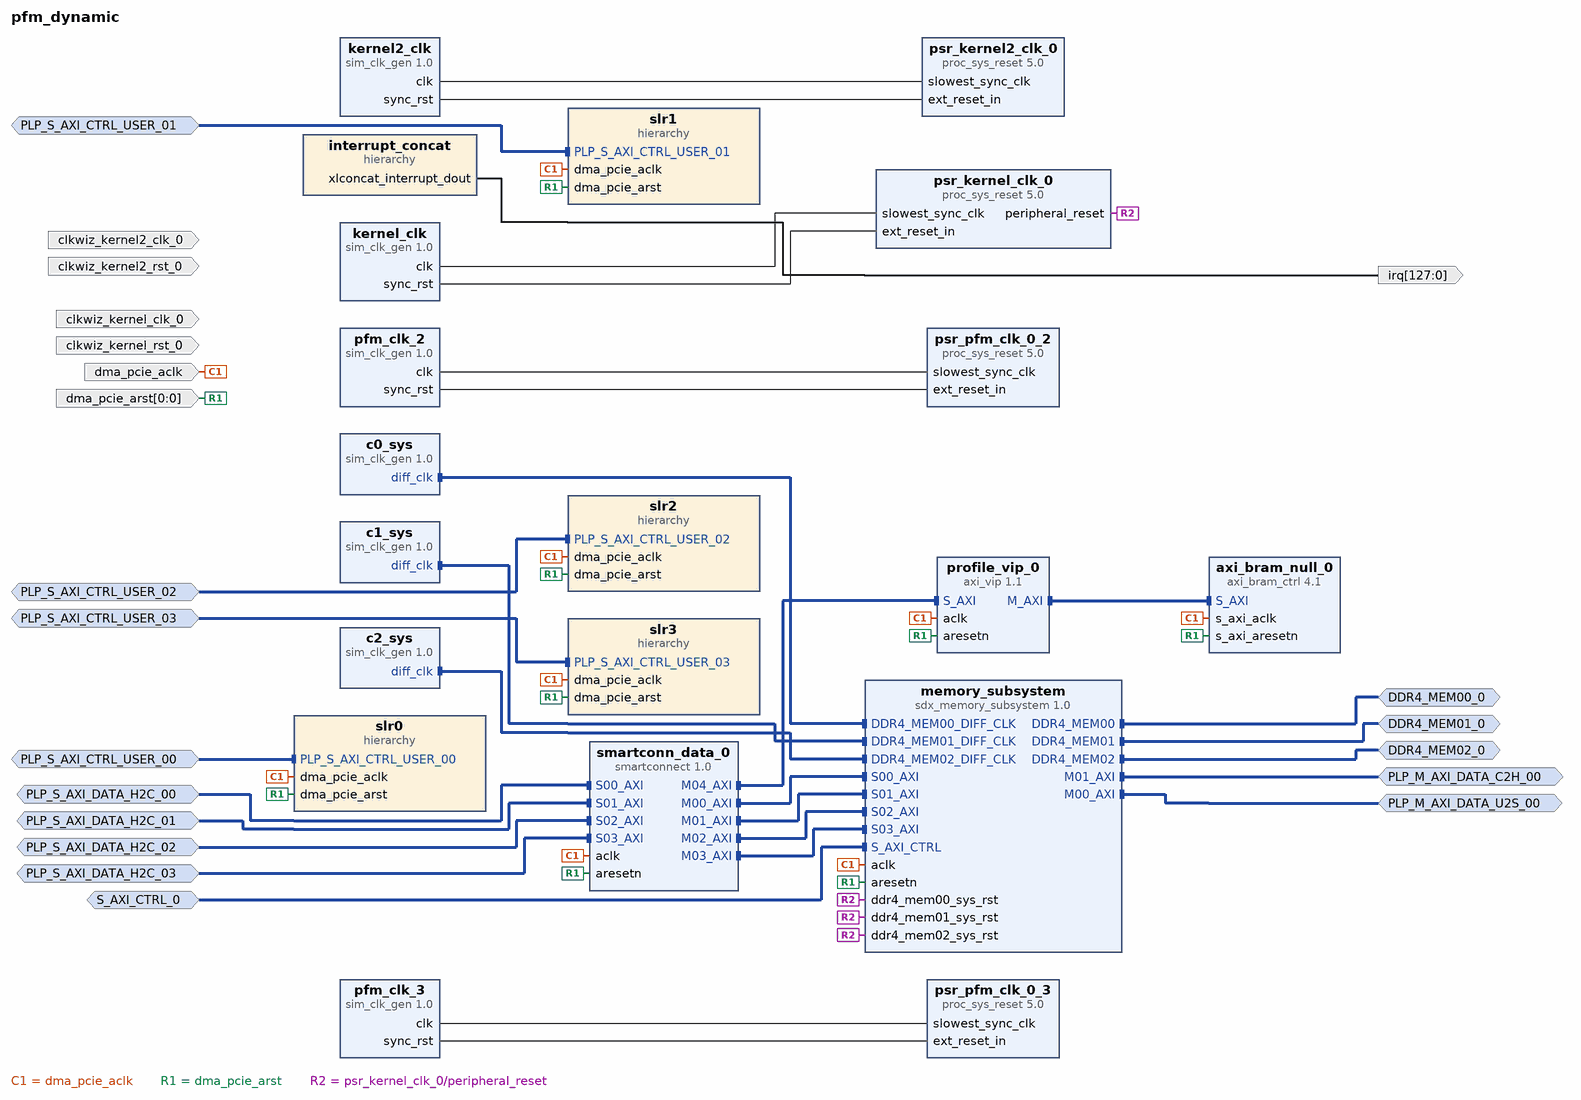
[diagram p0: block diagram of the top level]
# Vivado block design pfm_dynamic, xcu250-figd2104-2L-e, Vivado 2022.1
create_bd_design pfm_dynamic

create_bd_intf_port -mode Master -vlnv xilinx.com:interface:aximm_rtl:1.0 PLP_M_AXI_DATA_C2H_00
set_property -dict [list \
  CONFIG.ADDR_WIDTH 38 \
  CONFIG.DATA_WIDTH 32 \
  CONFIG.FREQ_HZ 300000000 \
  CONFIG.PROTOCOL AXI4 \
] [get_bd_intf_ports PLP_M_AXI_DATA_C2H_00]
create_bd_intf_port -mode Master -vlnv xilinx.com:interface:aximm_rtl:1.0 PLP_M_AXI_DATA_U2S_00
set_property -dict [list \
  CONFIG.ADDR_WIDTH 39 \
  CONFIG.DATA_WIDTH 512 \
  CONFIG.FREQ_HZ 300000000 \
  CONFIG.PROTOCOL AXI4 \
] [get_bd_intf_ports PLP_M_AXI_DATA_U2S_00]
create_bd_intf_port -mode Slave -vlnv xilinx.com:interface:aximm_rtl:1.0 PLP_S_AXI_DATA_H2C_00
set_property -dict [list \
  CONFIG.ADDR_WIDTH 64 \
  CONFIG.ARUSER_WIDTH 0 \
  CONFIG.AWUSER_WIDTH 0 \
  CONFIG.BUSER_WIDTH 0 \
  CONFIG.DATA_WIDTH 32 \
  CONFIG.FREQ_HZ 300000000 \
  CONFIG.HAS_BRESP 1 \
  CONFIG.HAS_BURST 1 \
  CONFIG.HAS_CACHE 0 \
  CONFIG.HAS_LOCK 0 \
  CONFIG.HAS_PROT 1 \
  CONFIG.HAS_QOS 0 \
  CONFIG.HAS_REGION 0 \
  CONFIG.HAS_RRESP 1 \
  CONFIG.HAS_WSTRB 1 \
  CONFIG.ID_WIDTH 1 \
  CONFIG.MAX_BURST_LENGTH 256 \
  CONFIG.NUM_READ_OUTSTANDING 2 \
  CONFIG.NUM_READ_THREADS 1 \
  CONFIG.NUM_WRITE_OUTSTANDING 2 \
  CONFIG.NUM_WRITE_THREADS 1 \
  CONFIG.PROTOCOL AXI4 \
  CONFIG.READ_WRITE_MODE READ_WRITE \
  CONFIG.RUSER_BITS_PER_BYTE 0 \
  CONFIG.RUSER_WIDTH 0 \
  CONFIG.SUPPORTS_NARROW_BURST 1 \
  CONFIG.WUSER_BITS_PER_BYTE 0 \
  CONFIG.WUSER_WIDTH 0 \
  CONFIG.master_id 1 \
] [get_bd_intf_ports PLP_S_AXI_DATA_H2C_00]
create_bd_intf_port -mode Slave -vlnv xilinx.com:interface:aximm_rtl:1.0 PLP_S_AXI_DATA_H2C_01
set_property -dict [list \
  CONFIG.ADDR_WIDTH 64 \
  CONFIG.ARUSER_WIDTH 0 \
  CONFIG.AWUSER_WIDTH 0 \
  CONFIG.BUSER_WIDTH 0 \
  CONFIG.DATA_WIDTH 32 \
  CONFIG.FREQ_HZ 300000000 \
  CONFIG.HAS_BRESP 1 \
  CONFIG.HAS_BURST 1 \
  CONFIG.HAS_CACHE 0 \
  CONFIG.HAS_LOCK 0 \
  CONFIG.HAS_PROT 1 \
  CONFIG.HAS_QOS 0 \
  CONFIG.HAS_REGION 0 \
  CONFIG.HAS_RRESP 1 \
  CONFIG.HAS_WSTRB 1 \
  CONFIG.ID_WIDTH 1 \
  CONFIG.MAX_BURST_LENGTH 256 \
  CONFIG.NUM_READ_OUTSTANDING 2 \
  CONFIG.NUM_READ_THREADS 1 \
  CONFIG.NUM_WRITE_OUTSTANDING 2 \
  CONFIG.NUM_WRITE_THREADS 1 \
  CONFIG.PROTOCOL AXI4 \
  CONFIG.READ_WRITE_MODE READ_WRITE \
  CONFIG.RUSER_BITS_PER_BYTE 0 \
  CONFIG.RUSER_WIDTH 0 \
  CONFIG.SUPPORTS_NARROW_BURST 1 \
  CONFIG.WUSER_BITS_PER_BYTE 0 \
  CONFIG.WUSER_WIDTH 0 \
  CONFIG.master_id 2 \
] [get_bd_intf_ports PLP_S_AXI_DATA_H2C_01]
create_bd_intf_port -mode Slave -vlnv xilinx.com:interface:aximm_rtl:1.0 PLP_S_AXI_DATA_H2C_02
set_property -dict [list \
  CONFIG.ADDR_WIDTH 64 \
  CONFIG.ARUSER_WIDTH 0 \
  CONFIG.AWUSER_WIDTH 0 \
  CONFIG.BUSER_WIDTH 0 \
  CONFIG.DATA_WIDTH 32 \
  CONFIG.FREQ_HZ 300000000 \
  CONFIG.HAS_BRESP 1 \
  CONFIG.HAS_BURST 1 \
  CONFIG.HAS_CACHE 0 \
  CONFIG.HAS_LOCK 0 \
  CONFIG.HAS_PROT 1 \
  CONFIG.HAS_QOS 0 \
  CONFIG.HAS_REGION 0 \
  CONFIG.HAS_RRESP 1 \
  CONFIG.HAS_WSTRB 1 \
  CONFIG.ID_WIDTH 1 \
  CONFIG.MAX_BURST_LENGTH 256 \
  CONFIG.NUM_READ_OUTSTANDING 2 \
  CONFIG.NUM_READ_THREADS 1 \
  CONFIG.NUM_WRITE_OUTSTANDING 2 \
  CONFIG.NUM_WRITE_THREADS 1 \
  CONFIG.PROTOCOL AXI4 \
  CONFIG.READ_WRITE_MODE READ_WRITE \
  CONFIG.RUSER_BITS_PER_BYTE 0 \
  CONFIG.RUSER_WIDTH 0 \
  CONFIG.SUPPORTS_NARROW_BURST 1 \
  CONFIG.WUSER_BITS_PER_BYTE 0 \
  CONFIG.WUSER_WIDTH 0 \
  CONFIG.master_id 3 \
] [get_bd_intf_ports PLP_S_AXI_DATA_H2C_02]
create_bd_intf_port -mode Slave -vlnv xilinx.com:interface:aximm_rtl:1.0 PLP_S_AXI_DATA_H2C_03
set_property -dict [list \
  CONFIG.ADDR_WIDTH 64 \
  CONFIG.ARUSER_WIDTH 0 \
  CONFIG.AWUSER_WIDTH 0 \
  CONFIG.BUSER_WIDTH 0 \
  CONFIG.DATA_WIDTH 32 \
  CONFIG.FREQ_HZ 300000000 \
  CONFIG.HAS_BRESP 1 \
  CONFIG.HAS_BURST 1 \
  CONFIG.HAS_CACHE 0 \
  CONFIG.HAS_LOCK 0 \
  CONFIG.HAS_PROT 1 \
  CONFIG.HAS_QOS 0 \
  CONFIG.HAS_REGION 0 \
  CONFIG.HAS_RRESP 1 \
  CONFIG.HAS_WSTRB 1 \
  CONFIG.ID_WIDTH 1 \
  CONFIG.MAX_BURST_LENGTH 256 \
  CONFIG.NUM_READ_OUTSTANDING 2 \
  CONFIG.NUM_READ_THREADS 1 \
  CONFIG.NUM_WRITE_OUTSTANDING 2 \
  CONFIG.NUM_WRITE_THREADS 1 \
  CONFIG.PROTOCOL AXI4 \
  CONFIG.READ_WRITE_MODE READ_WRITE \
  CONFIG.RUSER_BITS_PER_BYTE 0 \
  CONFIG.RUSER_WIDTH 0 \
  CONFIG.SUPPORTS_NARROW_BURST 1 \
  CONFIG.WUSER_BITS_PER_BYTE 0 \
  CONFIG.WUSER_WIDTH 0 \
  CONFIG.master_id 4 \
] [get_bd_intf_ports PLP_S_AXI_DATA_H2C_03]
create_bd_intf_port -mode Slave -vlnv xilinx.com:interface:aximm_rtl:1.0 PLP_S_AXI_CTRL_USER_00
set_property -dict [list \
  CONFIG.ADDR_WIDTH 64 \
  CONFIG.ARUSER_WIDTH 0 \
  CONFIG.AWUSER_WIDTH 0 \
  CONFIG.BUSER_WIDTH 0 \
  CONFIG.DATA_WIDTH 32 \
  CONFIG.FREQ_HZ 300000000 \
  CONFIG.HAS_BRESP 1 \
  CONFIG.HAS_BURST 0 \
  CONFIG.HAS_CACHE 0 \
  CONFIG.HAS_LOCK 0 \
  CONFIG.HAS_PROT 1 \
  CONFIG.HAS_QOS 0 \
  CONFIG.HAS_REGION 0 \
  CONFIG.HAS_RRESP 1 \
  CONFIG.HAS_WSTRB 1 \
  CONFIG.ID_WIDTH 0 \
  CONFIG.MAX_BURST_LENGTH 1 \
  CONFIG.NUM_READ_OUTSTANDING 2 \
  CONFIG.NUM_READ_THREADS 1 \
  CONFIG.NUM_WRITE_OUTSTANDING 2 \
  CONFIG.NUM_WRITE_THREADS 1 \
  CONFIG.PROTOCOL AXI4LITE \
  CONFIG.READ_WRITE_MODE READ_WRITE \
  CONFIG.RUSER_BITS_PER_BYTE 0 \
  CONFIG.RUSER_WIDTH 0 \
  CONFIG.SUPPORTS_NARROW_BURST 0 \
  CONFIG.WUSER_BITS_PER_BYTE 0 \
  CONFIG.WUSER_WIDTH 0 \
] [get_bd_intf_ports PLP_S_AXI_CTRL_USER_00]
create_bd_intf_port -mode Slave -vlnv xilinx.com:interface:aximm_rtl:1.0 PLP_S_AXI_CTRL_USER_01
set_property -dict [list \
  CONFIG.ADDR_WIDTH 64 \
  CONFIG.ARUSER_WIDTH 0 \
  CONFIG.AWUSER_WIDTH 0 \
  CONFIG.BUSER_WIDTH 0 \
  CONFIG.DATA_WIDTH 32 \
  CONFIG.FREQ_HZ 300000000 \
  CONFIG.HAS_BRESP 1 \
  CONFIG.HAS_BURST 0 \
  CONFIG.HAS_CACHE 0 \
  CONFIG.HAS_LOCK 0 \
  CONFIG.HAS_PROT 1 \
  CONFIG.HAS_QOS 0 \
  CONFIG.HAS_REGION 0 \
  CONFIG.HAS_RRESP 1 \
  CONFIG.HAS_WSTRB 1 \
  CONFIG.ID_WIDTH 0 \
  CONFIG.MAX_BURST_LENGTH 1 \
  CONFIG.NUM_READ_OUTSTANDING 2 \
  CONFIG.NUM_READ_THREADS 1 \
  CONFIG.NUM_WRITE_OUTSTANDING 2 \
  CONFIG.NUM_WRITE_THREADS 1 \
  CONFIG.PROTOCOL AXI4LITE \
  CONFIG.READ_WRITE_MODE READ_WRITE \
  CONFIG.RUSER_BITS_PER_BYTE 0 \
  CONFIG.RUSER_WIDTH 0 \
  CONFIG.SUPPORTS_NARROW_BURST 0 \
  CONFIG.WUSER_BITS_PER_BYTE 0 \
  CONFIG.WUSER_WIDTH 0 \
] [get_bd_intf_ports PLP_S_AXI_CTRL_USER_01]
create_bd_intf_port -mode Slave -vlnv xilinx.com:interface:aximm_rtl:1.0 PLP_S_AXI_CTRL_USER_02
set_property -dict [list \
  CONFIG.ADDR_WIDTH 64 \
  CONFIG.ARUSER_WIDTH 0 \
  CONFIG.AWUSER_WIDTH 0 \
  CONFIG.BUSER_WIDTH 0 \
  CONFIG.DATA_WIDTH 32 \
  CONFIG.FREQ_HZ 300000000 \
  CONFIG.HAS_BRESP 1 \
  CONFIG.HAS_BURST 0 \
  CONFIG.HAS_CACHE 0 \
  CONFIG.HAS_LOCK 0 \
  CONFIG.HAS_PROT 1 \
  CONFIG.HAS_QOS 0 \
  CONFIG.HAS_REGION 0 \
  CONFIG.HAS_RRESP 1 \
  CONFIG.HAS_WSTRB 1 \
  CONFIG.ID_WIDTH 0 \
  CONFIG.MAX_BURST_LENGTH 1 \
  CONFIG.NUM_READ_OUTSTANDING 2 \
  CONFIG.NUM_READ_THREADS 1 \
  CONFIG.NUM_WRITE_OUTSTANDING 2 \
  CONFIG.NUM_WRITE_THREADS 1 \
  CONFIG.PROTOCOL AXI4LITE \
  CONFIG.READ_WRITE_MODE READ_WRITE \
  CONFIG.RUSER_BITS_PER_BYTE 0 \
  CONFIG.RUSER_WIDTH 0 \
  CONFIG.SUPPORTS_NARROW_BURST 0 \
  CONFIG.WUSER_BITS_PER_BYTE 0 \
  CONFIG.WUSER_WIDTH 0 \
] [get_bd_intf_ports PLP_S_AXI_CTRL_USER_02]
create_bd_intf_port -mode Slave -vlnv xilinx.com:interface:aximm_rtl:1.0 PLP_S_AXI_CTRL_USER_03
set_property -dict [list \
  CONFIG.ADDR_WIDTH 64 \
  CONFIG.ARUSER_WIDTH 0 \
  CONFIG.AWUSER_WIDTH 0 \
  CONFIG.BUSER_WIDTH 0 \
  CONFIG.DATA_WIDTH 32 \
  CONFIG.FREQ_HZ 300000000 \
  CONFIG.HAS_BRESP 1 \
  CONFIG.HAS_BURST 0 \
  CONFIG.HAS_CACHE 0 \
  CONFIG.HAS_LOCK 0 \
  CONFIG.HAS_PROT 1 \
  CONFIG.HAS_QOS 0 \
  CONFIG.HAS_REGION 0 \
  CONFIG.HAS_RRESP 1 \
  CONFIG.HAS_WSTRB 1 \
  CONFIG.ID_WIDTH 0 \
  CONFIG.MAX_BURST_LENGTH 1 \
  CONFIG.NUM_READ_OUTSTANDING 2 \
  CONFIG.NUM_READ_THREADS 1 \
  CONFIG.NUM_WRITE_OUTSTANDING 2 \
  CONFIG.NUM_WRITE_THREADS 1 \
  CONFIG.PROTOCOL AXI4LITE \
  CONFIG.READ_WRITE_MODE READ_WRITE \
  CONFIG.RUSER_BITS_PER_BYTE 0 \
  CONFIG.RUSER_WIDTH 0 \
  CONFIG.SUPPORTS_NARROW_BURST 0 \
  CONFIG.WUSER_BITS_PER_BYTE 0 \
  CONFIG.WUSER_WIDTH 0 \
] [get_bd_intf_ports PLP_S_AXI_CTRL_USER_03]
create_bd_intf_port -mode Slave -vlnv xilinx.com:interface:aximm_rtl:1.0 S_AXI_CTRL_0
set_property -dict [list \
  CONFIG.ADDR_WIDTH 32 \
  CONFIG.ARUSER_WIDTH 0 \
  CONFIG.AWUSER_WIDTH 0 \
  CONFIG.BUSER_WIDTH 0 \
  CONFIG.DATA_WIDTH 32 \
  CONFIG.FREQ_HZ 300000000 \
  CONFIG.HAS_BRESP 1 \
  CONFIG.HAS_BURST 1 \
  CONFIG.HAS_CACHE 1 \
  CONFIG.HAS_LOCK 1 \
  CONFIG.HAS_PROT 1 \
  CONFIG.HAS_QOS 1 \
  CONFIG.HAS_REGION 1 \
  CONFIG.HAS_RRESP 1 \
  CONFIG.HAS_WSTRB 1 \
  CONFIG.ID_WIDTH 0 \
  CONFIG.MAX_BURST_LENGTH 1 \
  CONFIG.NUM_READ_OUTSTANDING 1 \
  CONFIG.NUM_READ_THREADS 1 \
  CONFIG.NUM_WRITE_OUTSTANDING 1 \
  CONFIG.NUM_WRITE_THREADS 1 \
  CONFIG.PROTOCOL AXI4LITE \
  CONFIG.READ_WRITE_MODE READ_WRITE \
  CONFIG.RUSER_BITS_PER_BYTE 0 \
  CONFIG.RUSER_WIDTH 0 \
  CONFIG.SUPPORTS_NARROW_BURST 0 \
  CONFIG.WUSER_BITS_PER_BYTE 0 \
  CONFIG.WUSER_WIDTH 0 \
] [get_bd_intf_ports S_AXI_CTRL_0]
create_bd_intf_port -mode Master -vlnv xilinx.com:interface:ddr4_rtl:1.0 DDR4_MEM00_0
create_bd_intf_port -mode Master -vlnv xilinx.com:interface:ddr4_rtl:1.0 DDR4_MEM01_0
create_bd_intf_port -mode Master -vlnv xilinx.com:interface:ddr4_rtl:1.0 DDR4_MEM02_0
create_bd_port -dir I -type clk clkwiz_kernel2_clk_0
set_property -dict {CONFIG.FREQ_HZ 500000000} [get_bd_ports clkwiz_kernel2_clk_0]
create_bd_port -dir I -type clk clkwiz_kernel_clk_0
set_property -dict {CONFIG.FREQ_HZ 300000000} [get_bd_ports clkwiz_kernel_clk_0]
create_bd_port -dir I -type rst clkwiz_kernel2_rst_0
create_bd_port -dir I -type rst clkwiz_kernel_rst_0
create_bd_port -dir I -type clk dma_pcie_aclk
set_property -dict [list \
  CONFIG.ASSOCIATED_BUSIF PLP_S_AXI_CTRL_USER_03:PLP_M_AXI_DATA_C2H_00:PLP_M_AXI_DATA_U2S_00:PLP_S_AXI_DATA_H2C_00:PLP_S_AXI_DATA_H2C_01:PLP_S_AXI_DATA_H2C_02:PLP_S_AXI_DATA_H2C_03:PLP_S_AXI_CTRL_USER_00:PLP_S_AXI_CTRL_USER_01:PLP_S_AXI_CTRL_USER_02:S_AXI_CTRL_0 \
  CONFIG.FREQ_HZ 300000000 \
] [get_bd_ports dma_pcie_aclk]
create_bd_port -dir O -from 127 -to 0 -type intr irq
create_bd_port -dir I -from 0 -to 0 -type rst dma_pcie_arst

create_bd_cell -type ip -vlnv xilinx.com:ip:sim_clk_gen:1.0 pfm_clk_2
set_property -dict {CONFIG.FREQ_HZ 50000000} [get_bd_cells pfm_clk_2]
create_bd_cell -type ip -vlnv xilinx.com:ip:proc_sys_reset:5.0 psr_pfm_clk_0_2
create_bd_cell -type ip -vlnv xilinx.com:ip:sim_clk_gen:1.0 pfm_clk_3
set_property -dict {CONFIG.FREQ_HZ 250000000} [get_bd_cells pfm_clk_3]
create_bd_cell -type ip -vlnv xilinx.com:ip:proc_sys_reset:5.0 psr_pfm_clk_0_3
create_bd_cell -type ip -vlnv xilinx.com:ip:sim_clk_gen:1.0 kernel2_clk
set_property -dict {CONFIG.FREQ_HZ 500000000} [get_bd_cells kernel2_clk]
create_bd_cell -type ip -vlnv xilinx.com:ip:sim_clk_gen:1.0 kernel_clk
set_property -dict {CONFIG.FREQ_HZ 300000000} [get_bd_cells kernel_clk]
create_bd_cell -type ip -vlnv xilinx.com:ip:proc_sys_reset:5.0 psr_kernel2_clk_0
create_bd_cell -type ip -vlnv xilinx.com:ip:proc_sys_reset:5.0 psr_kernel_clk_0
create_bd_cell -type ip -vlnv xilinx.com:ip:smartconnect:1.0 smartconn_data_0
set_property -dict {CONFIG.NUM_MI 5 CONFIG.NUM_SI 4} [get_bd_cells smartconn_data_0]
create_bd_cell -type hier interrupt_concat
create_bd_cell -type ip -vlnv xilinx.com:ip:sdx_memory_subsystem:1.0 memory_subsystem
set_property -dict [list \
  CONFIG.ADVANCED_PROPERTIES {resource_map_replication { S00_AXI {}  S01_AXI {}  S02_AXI {}  S03_AXI {} } plram_specifications {{SIZE 128K AXI_DATA_WIDTH 512 SLR_ASSIGNMENT SLR0} {SIZE 128K AXI_DATA_WIDTH 512 SLR_ASSIGNMENT SLR1} {SIZE 128K AXI_DATA_WIDTH 512 SLR_ASSIGNMENT SLR2} {SIZE 128K AXI_DATA_WIDTH 512 SLR_ASSIGNMENT SLR3}} resource_access_constraints {S00_AXI {DDR4_MEM00 PLRAM_MEM00 PLRAM_MEM01 PLRAM_MEM02 PLRAM_MEM03} S01_AXI {M00_AXI_MEM00 M01_AXI_MEM00} S02_AXI DDR4_MEM01 S03_AXI DDR4_MEM02} __temp_dsa_info {excluded_board_components xilinx.com:au250:ddr4_sdram_c1:1.4 axi_passthrough {xilinx.com:au250:ddr4_sdram_c1:1.4 {offset 0x5000000000 range 16G slr SLR1} M01_AXI {offset 0x2000000000 range 16G slr SLR2}}}} \
  CONFIG.NUM_CLKS 1 \
  CONFIG.NUM_SI 4 \
] [get_bd_cells memory_subsystem]
create_bd_cell -type ip -vlnv xilinx.com:ip:sim_clk_gen:1.0 c0_sys
set_property -dict {CONFIG.CLOCK_TYPE Differential CONFIG.FREQ_HZ 300000000} [get_bd_cells c0_sys]
create_bd_cell -type ip -vlnv xilinx.com:ip:sim_clk_gen:1.0 c1_sys
set_property -dict {CONFIG.CLOCK_TYPE Differential CONFIG.FREQ_HZ 300000000} [get_bd_cells c1_sys]
create_bd_cell -type ip -vlnv xilinx.com:ip:sim_clk_gen:1.0 c2_sys
set_property -dict {CONFIG.CLOCK_TYPE Differential CONFIG.FREQ_HZ 300000000} [get_bd_cells c2_sys]
create_bd_cell -type ip -vlnv xilinx.com:ip:axi_vip:1.1 profile_vip_0
set_property -dict {CONFIG.INTERFACE_MODE PASS_THROUGH} [get_bd_cells profile_vip_0]
create_bd_cell -type ip -vlnv xilinx.com:ip:axi_bram_ctrl:4.1 axi_bram_null_0
set_property -dict {CONFIG.DATA_WIDTH 64} [get_bd_cells axi_bram_null_0]
create_bd_cell -type hier slr0
create_bd_cell -type hier slr1
create_bd_cell -type hier slr2
create_bd_cell -type hier slr3

# ---- hierarchy /interrupt_concat ----
current_bd_instance /interrupt_concat
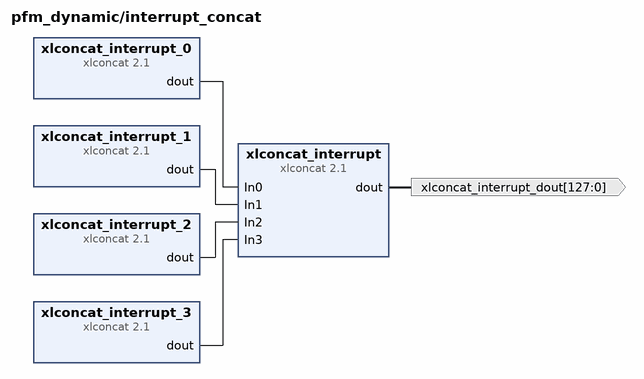
[diagram p1: block diagram inside /interrupt_concat]
create_bd_pin -dir O -from 127 -to 0 xlconcat_interrupt_dout

create_bd_cell -type ip -vlnv xilinx.com:ip:xlconcat:2.1 xlconcat_interrupt
set_property -dict {CONFIG.NUM_PORTS 4} [get_bd_cells xlconcat_interrupt]
create_bd_cell -type ip -vlnv xilinx.com:ip:xlconcat:2.1 xlconcat_interrupt_0
set_property -dict {CONFIG.NUM_PORTS 32} [get_bd_cells xlconcat_interrupt_0]
create_bd_cell -type ip -vlnv xilinx.com:ip:xlconcat:2.1 xlconcat_interrupt_1
set_property -dict {CONFIG.NUM_PORTS 32} [get_bd_cells xlconcat_interrupt_1]
create_bd_cell -type ip -vlnv xilinx.com:ip:xlconcat:2.1 xlconcat_interrupt_2
set_property -dict {CONFIG.NUM_PORTS 32} [get_bd_cells xlconcat_interrupt_2]
create_bd_cell -type ip -vlnv xilinx.com:ip:xlconcat:2.1 xlconcat_interrupt_3
set_property -dict {CONFIG.NUM_PORTS 32} [get_bd_cells xlconcat_interrupt_3]

# ---- hierarchy /slr0 ----
current_bd_instance /slr0
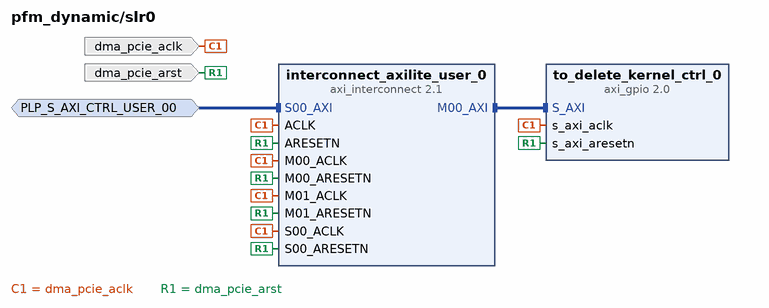
[diagram p2: block diagram inside /slr0]
create_bd_intf_pin -mode Slave -vlnv xilinx.com:interface:aximm_rtl:1.0 PLP_S_AXI_CTRL_USER_00
create_bd_pin -dir I -type clk dma_pcie_aclk
create_bd_pin -dir I -type rst dma_pcie_arst

create_bd_cell -type ip -vlnv xilinx.com:ip:axi_interconnect:2.1 interconnect_axilite_user_0
set_property -dict [list \
  CONFIG.M01_HAS_REGSLICE 1 \
  CONFIG.NUM_MI 2 \
  CONFIG.NUM_SI 1 \
  CONFIG.SLR_ASSIGNMENTS SLR0 \
] [get_bd_cells interconnect_axilite_user_0]
create_bd_cell -type ip -vlnv xilinx.com:ip:axi_gpio:2.0 to_delete_kernel_ctrl_0

# ---- hierarchy /slr1 ----
current_bd_instance /slr1
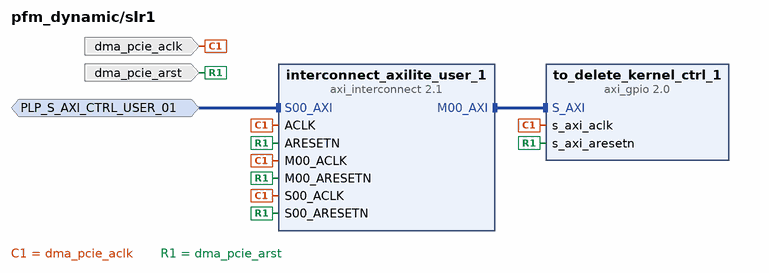
[diagram p3: block diagram inside /slr1]
create_bd_intf_pin -mode Slave -vlnv xilinx.com:interface:aximm_rtl:1.0 PLP_S_AXI_CTRL_USER_01
create_bd_pin -dir I -type clk dma_pcie_aclk
create_bd_pin -dir I -type rst dma_pcie_arst

create_bd_cell -type ip -vlnv xilinx.com:ip:axi_interconnect:2.1 interconnect_axilite_user_1
set_property -dict [list \
  CONFIG.M01_HAS_REGSLICE 1 \
  CONFIG.NUM_MI 1 \
  CONFIG.NUM_SI 1 \
  CONFIG.SLR_ASSIGNMENTS SLR1 \
] [get_bd_cells interconnect_axilite_user_1]
create_bd_cell -type ip -vlnv xilinx.com:ip:axi_gpio:2.0 to_delete_kernel_ctrl_1

# ---- hierarchy /slr2 ----
current_bd_instance /slr2
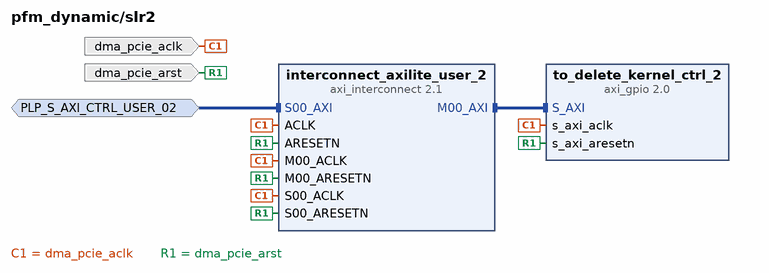
[diagram p4: block diagram inside /slr2]
create_bd_intf_pin -mode Slave -vlnv xilinx.com:interface:aximm_rtl:1.0 PLP_S_AXI_CTRL_USER_02
create_bd_pin -dir I -type clk dma_pcie_aclk
create_bd_pin -dir I -type rst dma_pcie_arst

create_bd_cell -type ip -vlnv xilinx.com:ip:axi_interconnect:2.1 interconnect_axilite_user_2
set_property -dict [list \
  CONFIG.M01_HAS_REGSLICE 1 \
  CONFIG.NUM_MI 1 \
  CONFIG.NUM_SI 1 \
  CONFIG.SLR_ASSIGNMENTS SLR2 \
] [get_bd_cells interconnect_axilite_user_2]
create_bd_cell -type ip -vlnv xilinx.com:ip:axi_gpio:2.0 to_delete_kernel_ctrl_2

# ---- hierarchy /slr3 ----
current_bd_instance /slr3
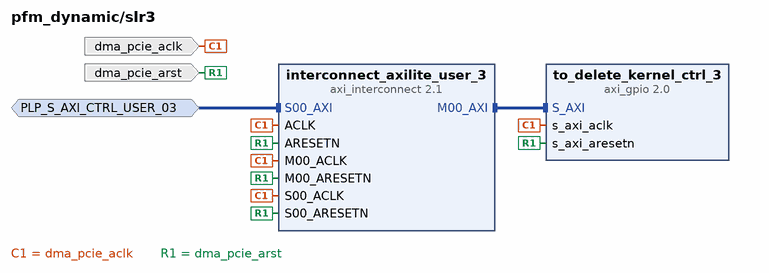
[diagram p5: block diagram inside /slr3]
create_bd_intf_pin -mode Slave -vlnv xilinx.com:interface:aximm_rtl:1.0 PLP_S_AXI_CTRL_USER_03
create_bd_pin -dir I -type clk dma_pcie_aclk
create_bd_pin -dir I -type rst dma_pcie_arst

create_bd_cell -type ip -vlnv xilinx.com:ip:axi_interconnect:2.1 interconnect_axilite_user_3
set_property -dict [list \
  CONFIG.M01_HAS_REGSLICE 1 \
  CONFIG.NUM_MI 1 \
  CONFIG.NUM_SI 1 \
  CONFIG.SLR_ASSIGNMENTS SLR3 \
] [get_bd_cells interconnect_axilite_user_3]
create_bd_cell -type ip -vlnv xilinx.com:ip:axi_gpio:2.0 to_delete_kernel_ctrl_3

# ---- connections ----

current_bd_instance /interrupt_concat
connect_bd_net [get_bd_pins xlconcat_interrupt_0/dout] [get_bd_pins xlconcat_interrupt/In0]
connect_bd_net [get_bd_pins xlconcat_interrupt_1/dout] [get_bd_pins xlconcat_interrupt/In1]
connect_bd_net [get_bd_pins xlconcat_interrupt_2/dout] [get_bd_pins xlconcat_interrupt/In2]
connect_bd_net [get_bd_pins xlconcat_interrupt_3/dout] [get_bd_pins xlconcat_interrupt/In3]
connect_bd_net [get_bd_pins xlconcat_interrupt/dout] [get_bd_pins xlconcat_interrupt_dout]
set_property PFM.IRQ {In0 {id 0} In1 {id 1} In2 {id 2} In3 {id 3} In4 {id 4} In5 {id 5} In6 {id 6} In7 {id 7} In8 {id 8} In9 {id 9}  In10 {id 10} In11 {id 11} In12 {id 12} In13 {id 13} In14 {id 14} In15 {id 15} In16 {id 16} In17 {id 17} In18 {id 18} In19 {id 19}  In20 {id 20} In21 {id 21} In22 {id 22} In23 {id 23} In24 {id 24} In25 {id 25} In26 {id 26} In27 {id 27} In28 {id 28} In29 {id 29}  In30 {id 30} In31 {id 31}} [get_bd_cells xlconcat_interrupt_0]
set_property PFM.IRQ {In0 {id 32} In1 {id 33} In2 {id 34} In3 {id 35} In4 {id 36} In5 {id 37} In6 {id 38} In7 {id 39} In8 {id 40}  In9 {id 41} In10 {id 42} In11 {id 43} In12 {id 44} In13 {id 45} In14 {id 46} In15 {id 47} In16 {id 48} In17 {id 49} In18 {id 50}  In19 {id 51} In20 {id 52} In21 {id 53} In22 {id 54} In23 {id 55} In24 {id 56} In25 {id 57} In26 {id 58} In27 {id 59} In28 {id 60}  In29 {id 61} In30 {id 62} In31 {id 63}} [get_bd_cells xlconcat_interrupt_1]
set_property PFM.IRQ {In0 {id 64} In1 {id 65} In2 {id 66} In3 {id 67} In4 {id 68} In5 {id 69} In6 {id 70} In7 {id 71} In8 {id 72} In9 {id 73} In10 {id 74}  In11 {id 75} In12 {id 76} In13 {id 77} In14 {id 78} In15 {id 79} In16 {id 80} In17 {id 81} In18 {id 82} In19 {id 83} In20 {id 84}  In21 {id 85} In22 {id 86} In23 {id 87} In24 {id 88} In25 {id 89} In26 {id 90} In27 {id 91} In28 {id 92} In29 {id 93}  In30 {id 94} In31 {id 95}} [get_bd_cells xlconcat_interrupt_2]
set_property PFM.IRQ {In0 {id 96} In1 {id 97} In2 {id 98} In3 {id 99} In4 {id 100} In5 {id 101} In6 {id 102} In7 {id 103} In8 {id 104} In9 {id 105}  In10 {id 106} In11 {id 107} In12 {id 108} In13 {id 109} In14 {id 110} In15 {id 111} In16 {id 112} In17 {id 113} In18 {id 114}  In19 {id 115} In20 {id 116} In21 {id 117} In22 {id 118} In23 {id 119} In24 {id 120} In25 {id 121} In26 {id 122} In27 {id 123}  In28 {id 124} In29 {id 125} In30 {id 126} In31 {id 127}} [get_bd_cells xlconcat_interrupt_3]

current_bd_instance /slr0
connect_bd_intf_net -intf_net interconnect_axilite_0_M00_AXI [get_bd_intf_pins interconnect_axilite_user_0/M00_AXI] [get_bd_intf_pins to_delete_kernel_ctrl_0/S_AXI]
connect_bd_intf_net -intf_net urp_ctrl_PLP_S_AXI_CTRL_USER_00 [get_bd_intf_pins PLP_S_AXI_CTRL_USER_00] [get_bd_intf_pins interconnect_axilite_user_0/S00_AXI]
connect_bd_net -net dma_pcie_aclk_net [get_bd_pins dma_pcie_aclk] \
  [get_bd_pins interconnect_axilite_user_0/M00_ACLK] [get_bd_pins interconnect_axilite_user_0/S00_ACLK] \
  [get_bd_pins interconnect_axilite_user_0/M01_ACLK] [get_bd_pins to_delete_kernel_ctrl_0/s_axi_aclk] \
  [get_bd_pins interconnect_axilite_user_0/ACLK]
connect_bd_net -net dma_pcie_arst_net [get_bd_pins dma_pcie_arst] \
  [get_bd_pins interconnect_axilite_user_0/M00_ARESETN] [get_bd_pins interconnect_axilite_user_0/S00_ARESETN] \
  [get_bd_pins interconnect_axilite_user_0/M01_ARESETN] [get_bd_pins to_delete_kernel_ctrl_0/s_axi_aresetn] \
  [get_bd_pins interconnect_axilite_user_0/ARESETN]
set_property HDL_ATTRIBUTE.DPA_AXILITE_MASTER primary [get_bd_cells interconnect_axilite_user_0]
set_property PFM.AXI_PORT {M02_AXI {memport "M_AXI_GP"} M03_AXI {memport "M_AXI_GP"} M04_AXI {memport "M_AXI_GP"} M05_AXI {memport "M_AXI_GP"} M06_AXI {memport "M_AXI_GP"} M07_AXI {memport "M_AXI_GP"} M08_AXI {memport "M_AXI_GP"} M09_AXI {memport "M_AXI_GP"} M10_AXI {memport "M_AXI_GP"} M11_AXI {memport "M_AXI_GP"} M12_AXI {memport "M_AXI_GP"} M13_AXI {memport "M_AXI_GP"} M14_AXI {memport "M_AXI_GP"} M15_AXI {memport "M_AXI_GP"} M16_AXI {memport "M_AXI_GP"} M17_AXI {memport "M_AXI_GP"} M18_AXI {memport "M_AXI_GP"} M19_AXI {memport "M_AXI_GP"} M20_AXI {memport "M_AXI_GP"} M21_AXI {memport "M_AXI_GP"} M22_AXI {memport "M_AXI_GP"} M23_AXI {memport "M_AXI_GP"} M24_AXI {memport "M_AXI_GP"} M25_AXI {memport "M_AXI_GP"} M26_AXI {memport "M_AXI_GP"} M27_AXI {memport "M_AXI_GP"} M28_AXI {memport "M_AXI_GP"} M29_AXI {memport "M_AXI_GP"} M30_AXI {memport "M_AXI_GP"} M31_AXI {memport "M_AXI_GP"}} [get_bd_cells interconnect_axilite_user_0]

current_bd_instance /slr1
connect_bd_intf_net -intf_net interconnect_axilite_1_M00_AXI [get_bd_intf_pins interconnect_axilite_user_1/M00_AXI] [get_bd_intf_pins to_delete_kernel_ctrl_1/S_AXI]
connect_bd_intf_net -intf_net urp_ctrl_PLP_S_AXI_CTRL_USER_01 [get_bd_intf_pins PLP_S_AXI_CTRL_USER_01] [get_bd_intf_pins interconnect_axilite_user_1/S00_AXI]
connect_bd_net -net dma_pcie_aclk_net [get_bd_pins dma_pcie_aclk] \
  [get_bd_pins interconnect_axilite_user_1/M00_ACLK] [get_bd_pins interconnect_axilite_user_1/S00_ACLK] \
  [get_bd_pins to_delete_kernel_ctrl_1/s_axi_aclk] [get_bd_pins interconnect_axilite_user_1/ACLK]
connect_bd_net -net dma_pcie_arst_net [get_bd_pins dma_pcie_arst] \
  [get_bd_pins interconnect_axilite_user_1/M00_ARESETN] [get_bd_pins interconnect_axilite_user_1/S00_ARESETN] \
  [get_bd_pins to_delete_kernel_ctrl_1/s_axi_aresetn] [get_bd_pins interconnect_axilite_user_1/ARESETN]
set_property PFM.AXI_PORT {M01_AXI {memport "M_AXI_GP"} M02_AXI {memport "M_AXI_GP"} M03_AXI {memport "M_AXI_GP"} M04_AXI {memport "M_AXI_GP"} M05_AXI {memport "M_AXI_GP"} M06_AXI {memport "M_AXI_GP"} M07_AXI {memport "M_AXI_GP"} M08_AXI {memport "M_AXI_GP"} M09_AXI {memport "M_AXI_GP"} M10_AXI {memport "M_AXI_GP"} M11_AXI {memport "M_AXI_GP"} M12_AXI {memport "M_AXI_GP"} M13_AXI {memport "M_AXI_GP"} M14_AXI {memport "M_AXI_GP"} M15_AXI {memport "M_AXI_GP"} M16_AXI {memport "M_AXI_GP"} M17_AXI {memport "M_AXI_GP"} M18_AXI {memport "M_AXI_GP"} M19_AXI {memport "M_AXI_GP"} M20_AXI {memport "M_AXI_GP"} M21_AXI {memport "M_AXI_GP"} M22_AXI {memport "M_AXI_GP"} M23_AXI {memport "M_AXI_GP"} M24_AXI {memport "M_AXI_GP"} M25_AXI {memport "M_AXI_GP"} M26_AXI {memport "M_AXI_GP"} M27_AXI {memport "M_AXI_GP"} M28_AXI {memport "M_AXI_GP"} M29_AXI {memport "M_AXI_GP"} M30_AXI {memport "M_AXI_GP"} M31_AXI {memport "M_AXI_GP"} M32_AXI {memport "M_AXI_GP"} M33_AXI {memport "M_AXI_GP"} M34_AXI {memport "M_AXI_GP"} M35_AXI {memport "M_AXI_GP"} M36_AXI {memport "M_AXI_GP"} M37_AXI {memport "M_AXI_GP"} M38_AXI {memport "M_AXI_GP"} M39_AXI {memport "M_AXI_GP"} M40_AXI {memport "M_AXI_GP"} M41_AXI {memport "M_AXI_GP"} M42_AXI {memport "M_AXI_GP"} M43_AXI {memport "M_AXI_GP"} M44_AXI {memport "M_AXI_GP"} M45_AXI {memport "M_AXI_GP"} M46_AXI {memport "M_AXI_GP"} M47_AXI {memport "M_AXI_GP"} M48_AXI {memport "M_AXI_GP"} M49_AXI {memport "M_AXI_GP"} M50_AXI {memport "M_AXI_GP"} M51_AXI {memport "M_AXI_GP"} M52_AXI {memport "M_AXI_GP"} M53_AXI {memport "M_AXI_GP"} M54_AXI {memport "M_AXI_GP"} M55_AXI {memport "M_AXI_GP"} M56_AXI {memport "M_AXI_GP"} M57_AXI {memport "M_AXI_GP"} M58_AXI {memport "M_AXI_GP"} M59_AXI {memport "M_AXI_GP"} M60_AXI {memport "M_AXI_GP"} M61_AXI {memport "M_AXI_GP"} M62_AXI {memport "M_AXI_GP"}} [get_bd_cells interconnect_axilite_user_1]

current_bd_instance /slr2
connect_bd_intf_net -intf_net interconnect_axilite_2_M00_AXI [get_bd_intf_pins interconnect_axilite_user_2/M00_AXI] [get_bd_intf_pins to_delete_kernel_ctrl_2/S_AXI]
connect_bd_intf_net -intf_net urp_ctrl_PLP_S_AXI_CTRL_USER_02 [get_bd_intf_pins PLP_S_AXI_CTRL_USER_02] [get_bd_intf_pins interconnect_axilite_user_2/S00_AXI]
connect_bd_net -net dma_pcie_aclk_net [get_bd_pins dma_pcie_aclk] \
  [get_bd_pins interconnect_axilite_user_2/M00_ACLK] [get_bd_pins interconnect_axilite_user_2/S00_ACLK] \
  [get_bd_pins to_delete_kernel_ctrl_2/s_axi_aclk] [get_bd_pins interconnect_axilite_user_2/ACLK]
connect_bd_net -net dma_pcie_arst_net [get_bd_pins dma_pcie_arst] \
  [get_bd_pins interconnect_axilite_user_2/M00_ARESETN] [get_bd_pins interconnect_axilite_user_2/S00_ARESETN] \
  [get_bd_pins to_delete_kernel_ctrl_2/s_axi_aresetn] [get_bd_pins interconnect_axilite_user_2/ARESETN]
set_property PFM.AXI_PORT {M01_AXI {memport "M_AXI_GP"} M02_AXI {memport "M_AXI_GP"} M03_AXI {memport "M_AXI_GP"} M04_AXI {memport "M_AXI_GP"} M05_AXI {memport "M_AXI_GP"} M06_AXI {memport "M_AXI_GP"} M07_AXI {memport "M_AXI_GP"} M08_AXI {memport "M_AXI_GP"} M09_AXI {memport "M_AXI_GP"} M10_AXI {memport "M_AXI_GP"} M11_AXI {memport "M_AXI_GP"} M12_AXI {memport "M_AXI_GP"} M13_AXI {memport "M_AXI_GP"} M14_AXI {memport "M_AXI_GP"} M15_AXI {memport "M_AXI_GP"} M16_AXI {memport "M_AXI_GP"} M17_AXI {memport "M_AXI_GP"} M18_AXI {memport "M_AXI_GP"} M19_AXI {memport "M_AXI_GP"} M20_AXI {memport "M_AXI_GP"} M21_AXI {memport "M_AXI_GP"} M22_AXI {memport "M_AXI_GP"} M23_AXI {memport "M_AXI_GP"} M24_AXI {memport "M_AXI_GP"} M25_AXI {memport "M_AXI_GP"} M26_AXI {memport "M_AXI_GP"} M27_AXI {memport "M_AXI_GP"} M28_AXI {memport "M_AXI_GP"} M29_AXI {memport "M_AXI_GP"} M30_AXI {memport "M_AXI_GP"}} [get_bd_cells interconnect_axilite_user_2]

current_bd_instance /slr3
connect_bd_intf_net -intf_net interconnect_axilite_3_M00_AXI [get_bd_intf_pins interconnect_axilite_user_3/M00_AXI] [get_bd_intf_pins to_delete_kernel_ctrl_3/S_AXI]
connect_bd_intf_net -intf_net urp_ctrl_PLP_S_AXI_CTRL_USER_03 [get_bd_intf_pins PLP_S_AXI_CTRL_USER_03] [get_bd_intf_pins interconnect_axilite_user_3/S00_AXI]
connect_bd_net -net dma_pcie_aclk_net [get_bd_pins dma_pcie_aclk] \
  [get_bd_pins interconnect_axilite_user_3/M00_ACLK] [get_bd_pins interconnect_axilite_user_3/S00_ACLK] \
  [get_bd_pins to_delete_kernel_ctrl_3/s_axi_aclk] [get_bd_pins interconnect_axilite_user_3/ACLK]
connect_bd_net -net dma_pcie_arst_net [get_bd_pins dma_pcie_arst] \
  [get_bd_pins interconnect_axilite_user_3/M00_ARESETN] [get_bd_pins interconnect_axilite_user_3/S00_ARESETN] \
  [get_bd_pins to_delete_kernel_ctrl_3/s_axi_aresetn] [get_bd_pins interconnect_axilite_user_3/ARESETN]
set_property PFM.AXI_PORT {M01_AXI {memport "M_AXI_GP"} M02_AXI {memport "M_AXI_GP"} M03_AXI {memport "M_AXI_GP"} M04_AXI {memport "M_AXI_GP"} M05_AXI {memport "M_AXI_GP"} M06_AXI {memport "M_AXI_GP"} M07_AXI {memport "M_AXI_GP"} M08_AXI {memport "M_AXI_GP"} M09_AXI {memport "M_AXI_GP"} M10_AXI {memport "M_AXI_GP"} M11_AXI {memport "M_AXI_GP"} M12_AXI {memport "M_AXI_GP"} M13_AXI {memport "M_AXI_GP"} M14_AXI {memport "M_AXI_GP"} M15_AXI {memport "M_AXI_GP"} M16_AXI {memport "M_AXI_GP"} M17_AXI {memport "M_AXI_GP"} M18_AXI {memport "M_AXI_GP"} M19_AXI {memport "M_AXI_GP"} M20_AXI {memport "M_AXI_GP"} M21_AXI {memport "M_AXI_GP"} M22_AXI {memport "M_AXI_GP"} M23_AXI {memport "M_AXI_GP"} M24_AXI {memport "M_AXI_GP"} M25_AXI {memport "M_AXI_GP"} M26_AXI {memport "M_AXI_GP"} M27_AXI {memport "M_AXI_GP"} M28_AXI {memport "M_AXI_GP"} M29_AXI {memport "M_AXI_GP"} M30_AXI {memport "M_AXI_GP"}} [get_bd_cells interconnect_axilite_user_3]

current_bd_instance /
connect_bd_intf_net -intf_net S_AXI_CTRL_0_1 [get_bd_intf_ports S_AXI_CTRL_0] [get_bd_intf_pins memory_subsystem/S_AXI_CTRL]
connect_bd_intf_net [get_bd_intf_pins c0_sys/diff_clk] [get_bd_intf_pins memory_subsystem/DDR4_MEM00_DIFF_CLK]
connect_bd_intf_net [get_bd_intf_pins c1_sys/diff_clk] [get_bd_intf_pins memory_subsystem/DDR4_MEM01_DIFF_CLK]
connect_bd_intf_net [get_bd_intf_pins c2_sys/diff_clk] [get_bd_intf_pins memory_subsystem/DDR4_MEM02_DIFF_CLK]
connect_bd_intf_net [get_bd_intf_ports DDR4_MEM00_0] [get_bd_intf_pins memory_subsystem/DDR4_MEM00]
connect_bd_intf_net [get_bd_intf_ports DDR4_MEM01_0] [get_bd_intf_pins memory_subsystem/DDR4_MEM01]
connect_bd_intf_net [get_bd_intf_ports DDR4_MEM02_0] [get_bd_intf_pins memory_subsystem/DDR4_MEM02]
connect_bd_intf_net [get_bd_intf_ports PLP_M_AXI_DATA_U2S_00] [get_bd_intf_pins memory_subsystem/M00_AXI]
connect_bd_intf_net [get_bd_intf_ports PLP_M_AXI_DATA_C2H_00] [get_bd_intf_pins memory_subsystem/M01_AXI]
connect_bd_intf_net [get_bd_intf_pins axi_bram_null_0/S_AXI] [get_bd_intf_pins profile_vip_0/M_AXI]
connect_bd_intf_net -intf_net smartconn_data_0_ICN_S_AXI_0_AXI [get_bd_intf_pins memory_subsystem/S00_AXI] [get_bd_intf_pins smartconn_data_0/M00_AXI]
connect_bd_intf_net -intf_net smartconn_data_0_ICN_S_AXI_1_AXI [get_bd_intf_pins memory_subsystem/S01_AXI] [get_bd_intf_pins smartconn_data_0/M01_AXI]
connect_bd_intf_net -intf_net smartconn_data_0_ICN_S_AXI_2_AXI [get_bd_intf_pins memory_subsystem/S02_AXI] [get_bd_intf_pins smartconn_data_0/M02_AXI]
connect_bd_intf_net -intf_net smartconn_data_0_ICN_S_AXI_3_AXI [get_bd_intf_pins memory_subsystem/S03_AXI] [get_bd_intf_pins smartconn_data_0/M03_AXI]
connect_bd_intf_net [get_bd_intf_pins smartconn_data_0/M04_AXI] [get_bd_intf_pins profile_vip_0/S_AXI]
connect_bd_intf_net -intf_net urp_conn_PLP_S_AXI_DATA_H2C_00 [get_bd_intf_ports PLP_S_AXI_DATA_H2C_00] [get_bd_intf_pins smartconn_data_0/S00_AXI]
connect_bd_intf_net -intf_net urp_conn_PLP_S_AXI_DATA_H2C_01 [get_bd_intf_ports PLP_S_AXI_DATA_H2C_01] [get_bd_intf_pins smartconn_data_0/S01_AXI]
connect_bd_intf_net -intf_net urp_conn_PLP_S_AXI_DATA_H2C_02 [get_bd_intf_ports PLP_S_AXI_DATA_H2C_02] [get_bd_intf_pins smartconn_data_0/S02_AXI]
connect_bd_intf_net -intf_net urp_conn_PLP_S_AXI_DATA_H2C_03 [get_bd_intf_ports PLP_S_AXI_DATA_H2C_03] [get_bd_intf_pins smartconn_data_0/S03_AXI]
connect_bd_intf_net -intf_net urp_ctrl_PLP_S_AXI_CTRL_USER_00 [get_bd_intf_ports PLP_S_AXI_CTRL_USER_00] [get_bd_intf_pins slr0/PLP_S_AXI_CTRL_USER_00]
connect_bd_intf_net -intf_net urp_ctrl_PLP_S_AXI_CTRL_USER_01 [get_bd_intf_ports PLP_S_AXI_CTRL_USER_01] [get_bd_intf_pins slr1/PLP_S_AXI_CTRL_USER_01]
connect_bd_intf_net -intf_net urp_ctrl_PLP_S_AXI_CTRL_USER_02 [get_bd_intf_ports PLP_S_AXI_CTRL_USER_02] [get_bd_intf_pins slr2/PLP_S_AXI_CTRL_USER_02]
connect_bd_intf_net -intf_net urp_ctrl_PLP_S_AXI_CTRL_USER_03 [get_bd_intf_ports PLP_S_AXI_CTRL_USER_03] [get_bd_intf_pins slr3/PLP_S_AXI_CTRL_USER_03]
connect_bd_net -net dma_pcie_aclk_net [get_bd_ports dma_pcie_aclk] \
  [get_bd_pins smartconn_data_0/aclk] [get_bd_pins memory_subsystem/aclk] [get_bd_pins profile_vip_0/aclk] \
  [get_bd_pins axi_bram_null_0/s_axi_aclk] [get_bd_pins slr0/dma_pcie_aclk] [get_bd_pins slr1/dma_pcie_aclk] \
  [get_bd_pins slr2/dma_pcie_aclk] [get_bd_pins slr3/dma_pcie_aclk]
connect_bd_net -net dma_pcie_arst_net [get_bd_ports dma_pcie_arst] \
  [get_bd_pins smartconn_data_0/aresetn] [get_bd_pins memory_subsystem/aresetn] [get_bd_pins profile_vip_0/aresetn] \
  [get_bd_pins axi_bram_null_0/s_axi_aresetn] [get_bd_pins slr0/dma_pcie_arst] [get_bd_pins slr1/dma_pcie_arst] \
  [get_bd_pins slr2/dma_pcie_arst] [get_bd_pins slr3/dma_pcie_arst]
connect_bd_net -net irq_cu_1 [get_bd_pins interrupt_concat/xlconcat_interrupt_dout] [get_bd_ports irq]
connect_bd_net [get_bd_pins kernel2_clk/clk] [get_bd_pins psr_kernel2_clk_0/slowest_sync_clk]
connect_bd_net [get_bd_pins kernel2_clk/sync_rst] [get_bd_pins psr_kernel2_clk_0/ext_reset_in]
connect_bd_net [get_bd_pins kernel_clk/clk] [get_bd_pins psr_kernel_clk_0/slowest_sync_clk]
connect_bd_net [get_bd_pins kernel_clk/sync_rst] [get_bd_pins psr_kernel_clk_0/ext_reset_in]
connect_bd_net [get_bd_pins pfm_clk_2/clk] [get_bd_pins psr_pfm_clk_0_2/slowest_sync_clk]
connect_bd_net [get_bd_pins pfm_clk_2/sync_rst] [get_bd_pins psr_pfm_clk_0_2/ext_reset_in]
connect_bd_net [get_bd_pins pfm_clk_3/clk] [get_bd_pins psr_pfm_clk_0_3/slowest_sync_clk]
connect_bd_net [get_bd_pins pfm_clk_3/sync_rst] [get_bd_pins psr_pfm_clk_0_3/ext_reset_in]
connect_bd_net [get_bd_pins psr_kernel_clk_0/peripheral_reset] \
  [get_bd_pins memory_subsystem/ddr4_mem00_sys_rst] [get_bd_pins memory_subsystem/ddr4_mem01_sys_rst] \
  [get_bd_pins memory_subsystem/ddr4_mem02_sys_rst]
set_property PFM.CLOCK {clk {id 2 is_default false proc_sys_reset psr_pfm_clk_0_2 status fixed}} [get_bd_cells pfm_clk_2]
set_property PFM.CLOCK {clk {id 3 is_default false proc_sys_reset psr_pfm_clk_0_3 status fixed}} [get_bd_cells pfm_clk_3]
set_property PFM.CLOCK {clk {id 1 is_default false  proc_sys_reset psr_kernel2_clk_0 status scalable}} [get_bd_cells kernel2_clk]
set_property PFM.CLOCK {clk {id 0 is_default true proc_sys_reset psr_kernel_clk_0 status scalable}} [get_bd_cells kernel_clk]
set_property HDL_ATTRIBUTE.DPA_TRACE_SLAVE true [get_bd_cells memory_subsystem]
set_property PFM.MEMSS {DDR {DDR4_MEM00 "auto true slr SLR0 sptag bank0" M00_AXI_MEM00 "auto preferred slr SLR1 sptag bank1" DDR4_MEM01 "auto true slr SLR2 sptag bank2" DDR4_MEM02 "auto true slr SLR3 sptag bank3"} PLRAM {PLRAM_MEM00 "auto false slr SLR0" PLRAM_MEM01 "auto false slr SLR1" PLRAM_MEM02 "auto false slr SLR2" PLRAM_MEM03 "auto false slr SLR3"} HOST {M01_AXI_MEM00 "auto false slr SLR2"}} [get_bd_cells memory_subsystem]

# ---- address map ----
assign_bd_address -offset 0x5000000000 -range 16G -target_address_space [get_bd_addr_spaces memory_subsystem/M00_AXI] [get_bd_addr_segs PLP_M_AXI_DATA_U2S_00/Reg]
assign_bd_address -offset 0x2000000000 -range 16G -target_address_space [get_bd_addr_spaces memory_subsystem/M01_AXI] [get_bd_addr_segs PLP_M_AXI_DATA_C2H_00/Reg]
assign_bd_address -offset 0x000000001C000000 -range 4K -target_address_space [get_bd_addr_spaces PLP_S_AXI_CTRL_USER_00] [get_bd_addr_segs slr0/to_delete_kernel_ctrl_0/S_AXI/Reg]
assign_bd_address -offset 0x000000001D000000 -range 4K -target_address_space [get_bd_addr_spaces PLP_S_AXI_CTRL_USER_01] [get_bd_addr_segs slr1/to_delete_kernel_ctrl_1/S_AXI/Reg]
assign_bd_address -offset 0x000000001E000000 -range 4K -target_address_space [get_bd_addr_spaces PLP_S_AXI_CTRL_USER_02] [get_bd_addr_segs slr2/to_delete_kernel_ctrl_2/S_AXI/Reg]
assign_bd_address -offset 0x000000001F000000 -range 4K -target_address_space [get_bd_addr_spaces PLP_S_AXI_CTRL_USER_03] [get_bd_addr_segs slr3/to_delete_kernel_ctrl_3/S_AXI/Reg]
assign_bd_address -offset 0x00000000C0000000 -range 8K -target_address_space [get_bd_addr_spaces PLP_S_AXI_DATA_H2C_00] [get_bd_addr_segs axi_bram_null_0/S_AXI/Mem0]
assign_bd_address -offset 0x0000002000000000 -range 16G -target_address_space [get_bd_addr_spaces PLP_S_AXI_DATA_H2C_00] [get_bd_addr_segs memory_subsystem/S01_AXI/M01_AXI_MEM00]
assign_bd_address -offset 0x0000003000000000 -range 128K -target_address_space [get_bd_addr_spaces PLP_S_AXI_DATA_H2C_00] [get_bd_addr_segs memory_subsystem/S00_AXI/PLRAM_MEM00]
assign_bd_address -offset 0x0000003000200000 -range 128K -target_address_space [get_bd_addr_spaces PLP_S_AXI_DATA_H2C_00] [get_bd_addr_segs memory_subsystem/S00_AXI/PLRAM_MEM01]
assign_bd_address -offset 0x0000003000400000 -range 128K -target_address_space [get_bd_addr_spaces PLP_S_AXI_DATA_H2C_00] [get_bd_addr_segs memory_subsystem/S00_AXI/PLRAM_MEM02]
assign_bd_address -offset 0x0000003000600000 -range 128K -target_address_space [get_bd_addr_spaces PLP_S_AXI_DATA_H2C_00] [get_bd_addr_segs memory_subsystem/S00_AXI/PLRAM_MEM03]
assign_bd_address -offset 0x0000004000000000 -range 16G -target_address_space [get_bd_addr_spaces PLP_S_AXI_DATA_H2C_00] [get_bd_addr_segs memory_subsystem/S00_AXI/DDR4_MEM00]
assign_bd_address -offset 0x0000005000000000 -range 16G -target_address_space [get_bd_addr_spaces PLP_S_AXI_DATA_H2C_00] [get_bd_addr_segs memory_subsystem/S01_AXI/M00_AXI_MEM00]
assign_bd_address -offset 0x0000006000000000 -range 16G -target_address_space [get_bd_addr_spaces PLP_S_AXI_DATA_H2C_00] [get_bd_addr_segs memory_subsystem/S02_AXI/DDR4_MEM01]
assign_bd_address -offset 0x0000007000000000 -range 16G -target_address_space [get_bd_addr_spaces PLP_S_AXI_DATA_H2C_00] [get_bd_addr_segs memory_subsystem/S03_AXI/DDR4_MEM02]
assign_bd_address -offset 0x00000000C0000000 -range 8K -target_address_space [get_bd_addr_spaces PLP_S_AXI_DATA_H2C_01] [get_bd_addr_segs axi_bram_null_0/S_AXI/Mem0]
assign_bd_address -offset 0x0000002000000000 -range 16G -target_address_space [get_bd_addr_spaces PLP_S_AXI_DATA_H2C_01] [get_bd_addr_segs memory_subsystem/S01_AXI/M01_AXI_MEM00]
assign_bd_address -offset 0x0000003000000000 -range 128K -target_address_space [get_bd_addr_spaces PLP_S_AXI_DATA_H2C_01] [get_bd_addr_segs memory_subsystem/S00_AXI/PLRAM_MEM00]
assign_bd_address -offset 0x0000003000200000 -range 128K -target_address_space [get_bd_addr_spaces PLP_S_AXI_DATA_H2C_01] [get_bd_addr_segs memory_subsystem/S00_AXI/PLRAM_MEM01]
assign_bd_address -offset 0x0000003000400000 -range 128K -target_address_space [get_bd_addr_spaces PLP_S_AXI_DATA_H2C_01] [get_bd_addr_segs memory_subsystem/S00_AXI/PLRAM_MEM02]
assign_bd_address -offset 0x0000003000600000 -range 128K -target_address_space [get_bd_addr_spaces PLP_S_AXI_DATA_H2C_01] [get_bd_addr_segs memory_subsystem/S00_AXI/PLRAM_MEM03]
assign_bd_address -offset 0x0000004000000000 -range 16G -target_address_space [get_bd_addr_spaces PLP_S_AXI_DATA_H2C_01] [get_bd_addr_segs memory_subsystem/S00_AXI/DDR4_MEM00]
assign_bd_address -offset 0x0000005000000000 -range 16G -target_address_space [get_bd_addr_spaces PLP_S_AXI_DATA_H2C_01] [get_bd_addr_segs memory_subsystem/S01_AXI/M00_AXI_MEM00]
assign_bd_address -offset 0x0000006000000000 -range 16G -target_address_space [get_bd_addr_spaces PLP_S_AXI_DATA_H2C_01] [get_bd_addr_segs memory_subsystem/S02_AXI/DDR4_MEM01]
assign_bd_address -offset 0x0000007000000000 -range 16G -target_address_space [get_bd_addr_spaces PLP_S_AXI_DATA_H2C_01] [get_bd_addr_segs memory_subsystem/S03_AXI/DDR4_MEM02]
assign_bd_address -offset 0x00000000C0000000 -range 8K -target_address_space [get_bd_addr_spaces PLP_S_AXI_DATA_H2C_02] [get_bd_addr_segs axi_bram_null_0/S_AXI/Mem0]
assign_bd_address -offset 0x0000002000000000 -range 16G -target_address_space [get_bd_addr_spaces PLP_S_AXI_DATA_H2C_02] [get_bd_addr_segs memory_subsystem/S01_AXI/M01_AXI_MEM00]
assign_bd_address -offset 0x0000003000000000 -range 128K -target_address_space [get_bd_addr_spaces PLP_S_AXI_DATA_H2C_02] [get_bd_addr_segs memory_subsystem/S00_AXI/PLRAM_MEM00]
assign_bd_address -offset 0x0000003000200000 -range 128K -target_address_space [get_bd_addr_spaces PLP_S_AXI_DATA_H2C_02] [get_bd_addr_segs memory_subsystem/S00_AXI/PLRAM_MEM01]
assign_bd_address -offset 0x0000003000400000 -range 128K -target_address_space [get_bd_addr_spaces PLP_S_AXI_DATA_H2C_02] [get_bd_addr_segs memory_subsystem/S00_AXI/PLRAM_MEM02]
assign_bd_address -offset 0x0000003000600000 -range 128K -target_address_space [get_bd_addr_spaces PLP_S_AXI_DATA_H2C_02] [get_bd_addr_segs memory_subsystem/S00_AXI/PLRAM_MEM03]
assign_bd_address -offset 0x0000004000000000 -range 16G -target_address_space [get_bd_addr_spaces PLP_S_AXI_DATA_H2C_02] [get_bd_addr_segs memory_subsystem/S00_AXI/DDR4_MEM00]
assign_bd_address -offset 0x0000005000000000 -range 16G -target_address_space [get_bd_addr_spaces PLP_S_AXI_DATA_H2C_02] [get_bd_addr_segs memory_subsystem/S01_AXI/M00_AXI_MEM00]
assign_bd_address -offset 0x0000006000000000 -range 16G -target_address_space [get_bd_addr_spaces PLP_S_AXI_DATA_H2C_02] [get_bd_addr_segs memory_subsystem/S02_AXI/DDR4_MEM01]
assign_bd_address -offset 0x0000007000000000 -range 16G -target_address_space [get_bd_addr_spaces PLP_S_AXI_DATA_H2C_02] [get_bd_addr_segs memory_subsystem/S03_AXI/DDR4_MEM02]
assign_bd_address -offset 0x00000000C0000000 -range 8K -target_address_space [get_bd_addr_spaces PLP_S_AXI_DATA_H2C_03] [get_bd_addr_segs axi_bram_null_0/S_AXI/Mem0]
assign_bd_address -offset 0x0000002000000000 -range 16G -target_address_space [get_bd_addr_spaces PLP_S_AXI_DATA_H2C_03] [get_bd_addr_segs memory_subsystem/S01_AXI/M01_AXI_MEM00]
assign_bd_address -offset 0x0000003000000000 -range 128K -target_address_space [get_bd_addr_spaces PLP_S_AXI_DATA_H2C_03] [get_bd_addr_segs memory_subsystem/S00_AXI/PLRAM_MEM00]
assign_bd_address -offset 0x0000003000200000 -range 128K -target_address_space [get_bd_addr_spaces PLP_S_AXI_DATA_H2C_03] [get_bd_addr_segs memory_subsystem/S00_AXI/PLRAM_MEM01]
assign_bd_address -offset 0x0000003000400000 -range 128K -target_address_space [get_bd_addr_spaces PLP_S_AXI_DATA_H2C_03] [get_bd_addr_segs memory_subsystem/S00_AXI/PLRAM_MEM02]
assign_bd_address -offset 0x0000003000600000 -range 128K -target_address_space [get_bd_addr_spaces PLP_S_AXI_DATA_H2C_03] [get_bd_addr_segs memory_subsystem/S00_AXI/PLRAM_MEM03]
assign_bd_address -offset 0x0000004000000000 -range 16G -target_address_space [get_bd_addr_spaces PLP_S_AXI_DATA_H2C_03] [get_bd_addr_segs memory_subsystem/S00_AXI/DDR4_MEM00]
assign_bd_address -offset 0x0000005000000000 -range 16G -target_address_space [get_bd_addr_spaces PLP_S_AXI_DATA_H2C_03] [get_bd_addr_segs memory_subsystem/S01_AXI/M00_AXI_MEM00]
assign_bd_address -offset 0x0000006000000000 -range 16G -target_address_space [get_bd_addr_spaces PLP_S_AXI_DATA_H2C_03] [get_bd_addr_segs memory_subsystem/S02_AXI/DDR4_MEM01]
assign_bd_address -offset 0x0000007000000000 -range 16G -target_address_space [get_bd_addr_spaces PLP_S_AXI_DATA_H2C_03] [get_bd_addr_segs memory_subsystem/S03_AXI/DDR4_MEM02]
assign_bd_address -offset 0x44A00000 -range 64K -target_address_space [get_bd_addr_spaces S_AXI_CTRL_0] [get_bd_addr_segs memory_subsystem/S_AXI_CTRL/DDR4_MEM00_CTRL]
exclude_bd_addr_seg -offset 0x44A10000 -range 64K -target_address_space [get_bd_addr_spaces S_AXI_CTRL_0] [get_bd_addr_segs memory_subsystem/S_AXI_CTRL/DDR4_MEM01_CTRL]
exclude_bd_addr_seg -offset 0x44A20000 -range 64K -target_address_space [get_bd_addr_spaces S_AXI_CTRL_0] [get_bd_addr_segs memory_subsystem/S_AXI_CTRL/DDR4_MEM02_CTRL]

validate_bd_design
save_bd_design
